# EAGLE design tpms_breakout (EAGLE 9.6.2)

## Sheet 1 of 2
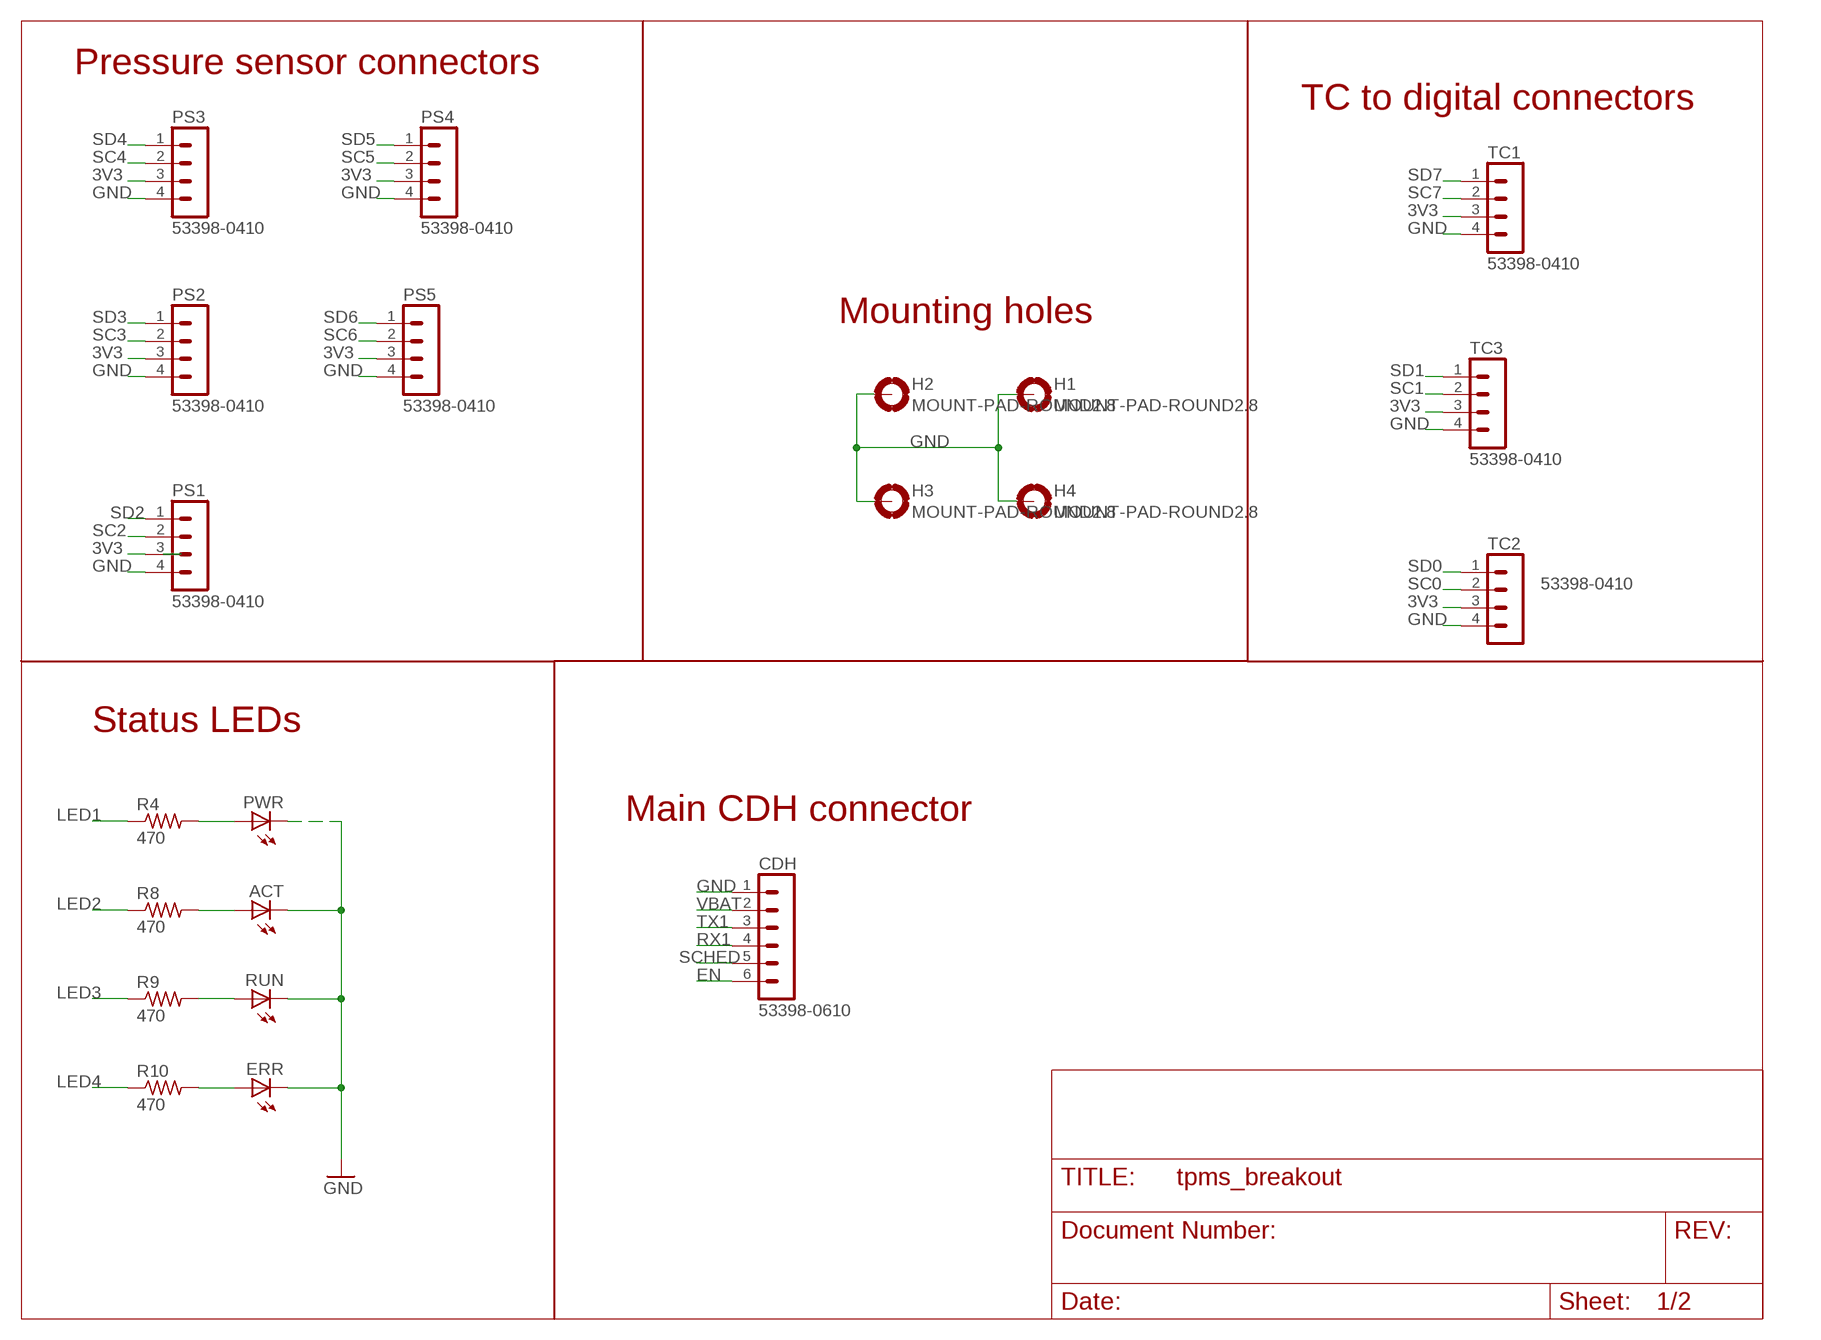
[diagram p0: schematic, sheet 1]

### Parts
ACT  LEDCHIP-LED0603  [CHIP-LED0603]
CDH  53398-0610  [53398-0610]
ERR  LEDCHIP-LED0603  [CHIP-LED0603]
H1  MOUNT-PAD-ROUND2.8  [2,8-PAD]
H2  MOUNT-PAD-ROUND2.8  [2,8-PAD]
H3  MOUNT-PAD-ROUND2.8  [2,8-PAD]
H4  MOUNT-PAD-ROUND2.8  [2,8-PAD]
PS1  53398-0410  [53398-0410]
PS2  53398-0410  [53398-0410]
PS3  53398-0410  [53398-0410]
PS4  53398-0410  [53398-0410]
PS5  53398-0410  [53398-0410]
PWR  LEDCHIP-LED0603  [CHIP-LED0603]
R4  470  R-US_R0603  [R0603]
R8  470  R-US_R0603  [R0603]
R9  470  R-US_R0603  [R0603]
R10  470  R-US_R0603  [R0603]
RUN  LEDCHIP-LED0603  [CHIP-LED0603]
TC1  53398-0410  [53398-0410]
TC2  53398-0410  [53398-0410]
TC3  53398-0410  [53398-0410]

### Nets
3V3: PS1.3 PS2.3 PS3.3 PS4.3 PS5.3 TC1.3 TC2.3 TC3.3 ; also sheet 2
EN: CDH.6 ; also sheet 2
GND: ACT.C CDH.1 ERR.C H1.B2,8(MOUNT) H2.B2,8(MOUNT) H3.B2,8(MOUNT) H4.B2,8(MOUNT) PS1.4 PS2.4 PS3.4 PS4.4 PS5.4 PWR.C RUN.C TC1.4 TC2.4 TC3.4 ; also sheet 2
LED1: R4.1 ; also sheet 2
LED2: R8.1 ; also sheet 2
LED3: R9.1 ; also sheet 2
LED4: R10.1 ; also sheet 2
N$20: PWR.A R4.2
N$21: ACT.A R8.2
N$22: R9.2 RUN.A
N$23: ERR.A R10.2
RX1: CDH.4 ; also sheet 2
SC0: TC2.2 ; also sheet 2
SC1: TC3.2 ; also sheet 2
SC2: PS1.2 ; also sheet 2
SC3: PS2.2 ; also sheet 2
SC4: PS3.2 ; also sheet 2
SC5: PS4.2 ; also sheet 2
SC6: PS5.2 ; also sheet 2
SC7: TC1.2 ; also sheet 2
SCHED: CDH.5 ; also sheet 2
SD0: TC2.1 ; also sheet 2
SD1: TC3.1 ; also sheet 2
SD2: PS1.1 ; also sheet 2
SD3: PS2.1 ; also sheet 2
SD4: PS3.1 ; also sheet 2
SD5: PS4.1 ; also sheet 2
SD6: PS5.1 ; also sheet 2
SD7: TC1.1 ; also sheet 2
TX1: CDH.3 ; also sheet 2
VBAT: CDH.2 ; also sheet 2

### Notes on the sheet
- Pressure sensor connectors
- TC to digital connectors
- Mounting holes
- Status LEDs
- Main CDH connector

## Sheet 2 of 2
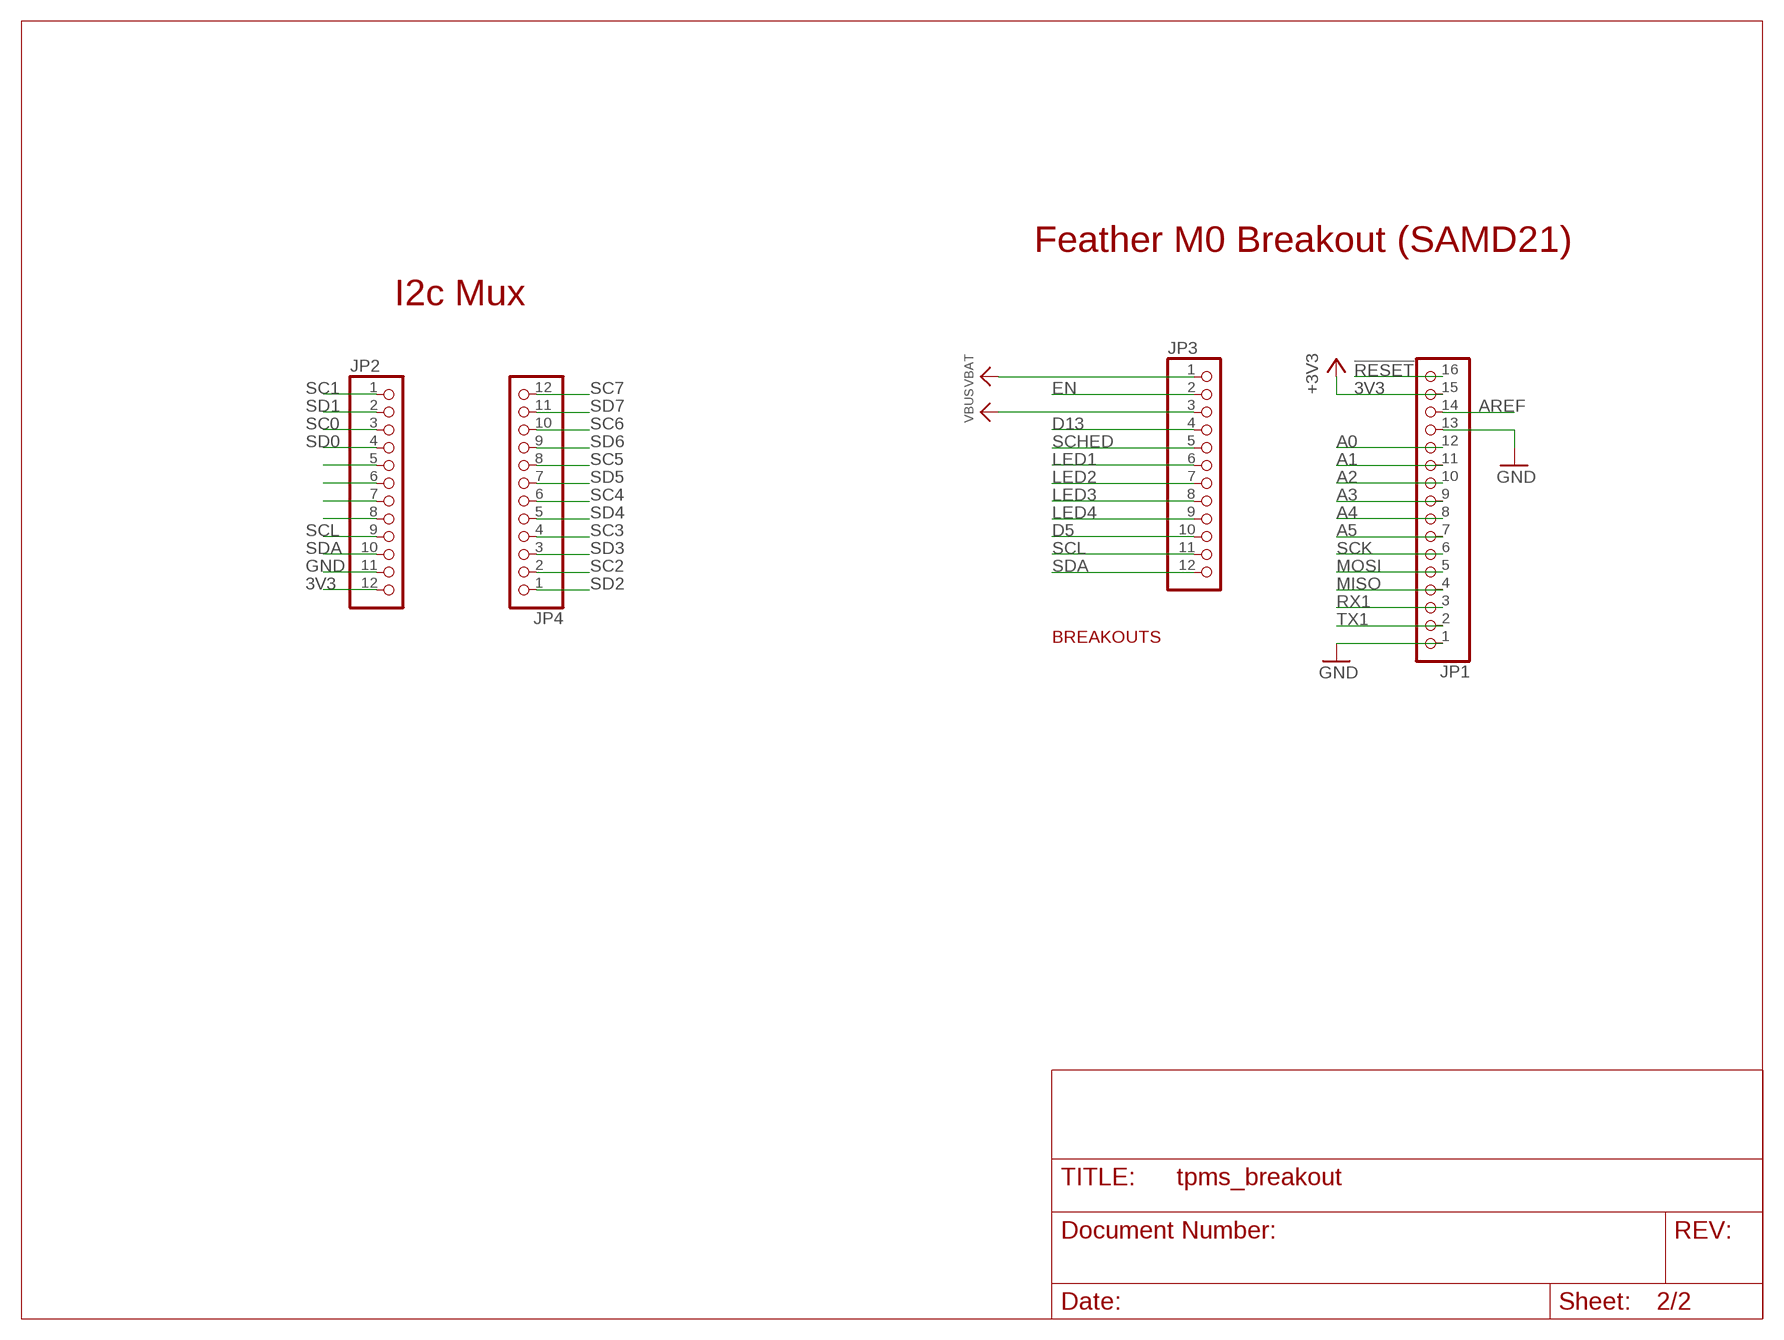
[diagram p1: schematic, sheet 2]

### Parts
JP1  HEADER-1X16ROUND  [1X16_ROUND]
JP2  HEADER-1X12  [1X12_ROUND]
JP3  HEADER-1X12  [1X12_ROUND]
JP4  HEADER-1X12  [1X12_ROUND]

### Nets
3V3: JP1.15 JP2.12 ; supply symbol labelled +3V3 ; also sheet 1
!RESET: JP1.16
A0: JP1.12
A1: JP1.11
A2: JP1.10
A3: JP1.9
A4: JP1.8
A5: JP1.7
AREF: JP1.14
D5: JP3.10
D13: JP3.4
EN: JP3.2 ; also sheet 1
GND: JP1.1 JP1.13 JP2.11 ; also sheet 1
LED1: JP3.6 ; also sheet 1
LED2: JP3.7 ; also sheet 1
LED3: JP3.8 ; also sheet 1
LED4: JP3.9 ; also sheet 1
MISO: JP1.4
MOSI: JP1.5
N$5: JP2.5
N$6: JP2.6
N$7: JP2.7
N$8: JP2.8
RX1: JP1.3 ; also sheet 1
SC0: JP2.3 ; also sheet 1
SC1: JP2.1 ; also sheet 1
SC2: JP4.2 ; also sheet 1
SC3: JP4.4 ; also sheet 1
SC4: JP4.6 ; also sheet 1
SC5: JP4.8 ; also sheet 1
SC6: JP4.10 ; also sheet 1
SC7: JP4.12 ; also sheet 1
SCHED: JP3.5 ; also sheet 1
SCK: JP1.6
SCL: JP2.9 JP3.11
SD0: JP2.4 ; also sheet 1
SD1: JP2.2 ; also sheet 1
SD2: JP4.1 ; also sheet 1
SD3: JP4.3 ; also sheet 1
SD4: JP4.5 ; also sheet 1
SD5: JP4.7 ; also sheet 1
SD6: JP4.9 ; also sheet 1
SD7: JP4.11 ; also sheet 1
SDA: JP2.10 JP3.12
TX1: JP1.2 ; also sheet 1
VBAT: JP3.1 ; also sheet 1
VBUS: JP3.3

### Notes on the sheet
- Feather M0 Breakout (SAMD21)
- I2c Mux
- BREAKOUTS

## Library data of the parts
ACT ERR PWR RUN = adafruit:LED: LED OSRAM: - CHIPLED LG R971, LG N971, LY N971, LG Q971, LY Q971, LO R971, LY R971 LH N974, LH R974 LS Q976, LO Q976, LY Q976 LO Q996 - Hyper CHIPLED LW Q18S LB Q993, LB Q99A, LB R99A - SideLED LS A670, LO A670, LY A670, LG A670, LP A670 LB A673, LV A673, LT A673, LW A673 LH A674 LY A675 LS A676, LA A676, LO A676, LY A676, LW A676 LS A679, LY A679, LG A679 - Hyper Micro SIDELED® LS Y876, LA Y876, LO Y876, LY Y876 LT Y87S - SmartLED LW L88C, LW L88S LB L89C, LB L89S, LG L890 LS L89K, LO L89K, LY L89K LS L896, LA L896, LO L896, LY L896 - TOPLED LS T670, LO T670, LY T670, LG T670, LP T670 LSG T670, LSP T670, LSY T670, LOP T670, LYG T670 LG T671, LOG T671, LSG T671 LB T673, LV T673, LT T673, LW T673 LH T674 LS T676, LA T676, LO T676, LY T676, LB T676, LH T676, LSB T676, LW T676 LB T67C, LV T67C, LT T67C, LS T67K, LO T67K, LY T67K, LW E67C LS E67B, LA E67B, LO E67B, LY E67B, LB E67C, LV E67C, LT E67C LW T67C LS T679, LY T679, LG T679 LS T770, LO T770, LY T770, LG T770, LP T770 LB T773, LV T773, LT T773, LW T773 LH T774 LS E675, LA E675, LY E675, LS T675 LS T776, LA T776, LO T776, LY T776, LB T776 LHGB T686 LT T68C, LB T68C - Hyper Mini TOPLED® LB M676 - Mini TOPLED Santana® LG M470 LS M47K, LO M47K, LY M47K Source: http://www.osram.convergy.de/
CDH = con-molex-picoblade:53398-0610: HEADER
H1-H4 = holes:MOUNT-PAD-ROUND: MOUNTING PAD, round
JP1 = microbuilder:HEADER-1X16: PIN HEADER
JP2-JP4 = microbuilder:HEADER-1X12
PS1-PS5 TC1-TC3 = con-molex-picoblade:53398-0410: HEADER
R4 R8-R10 = rcl:R-US_: RESISTOR, American symbol; SPICEPREFIX: R

## Board
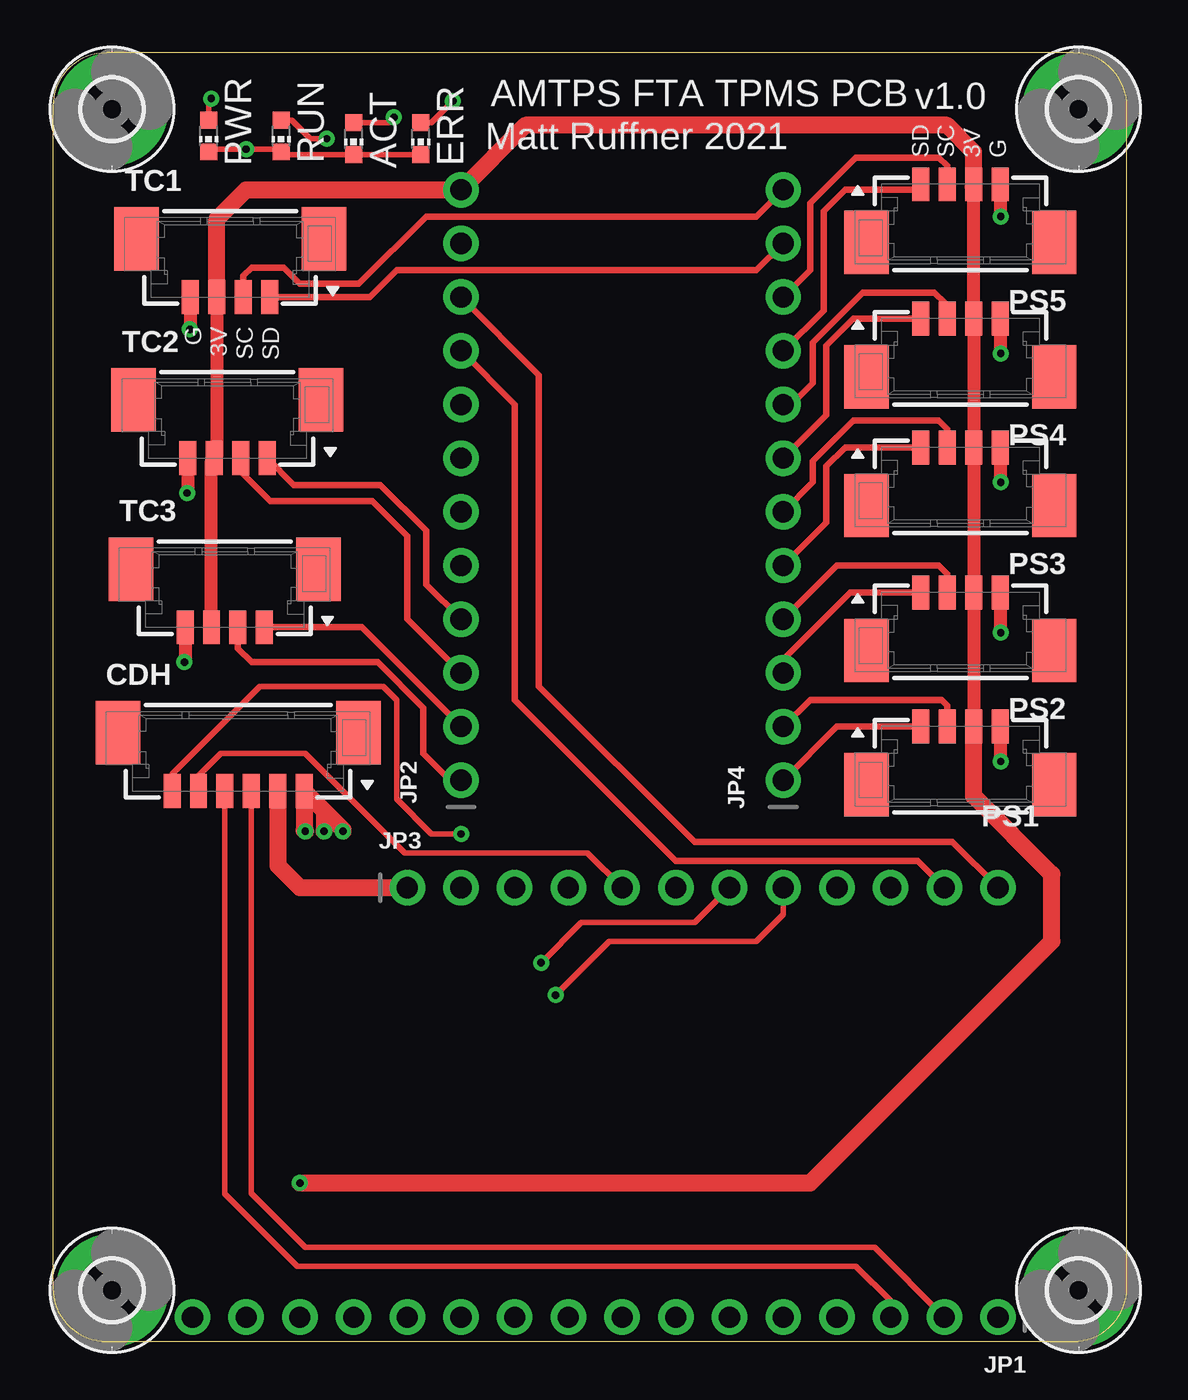
[diagram p2: board, top side]
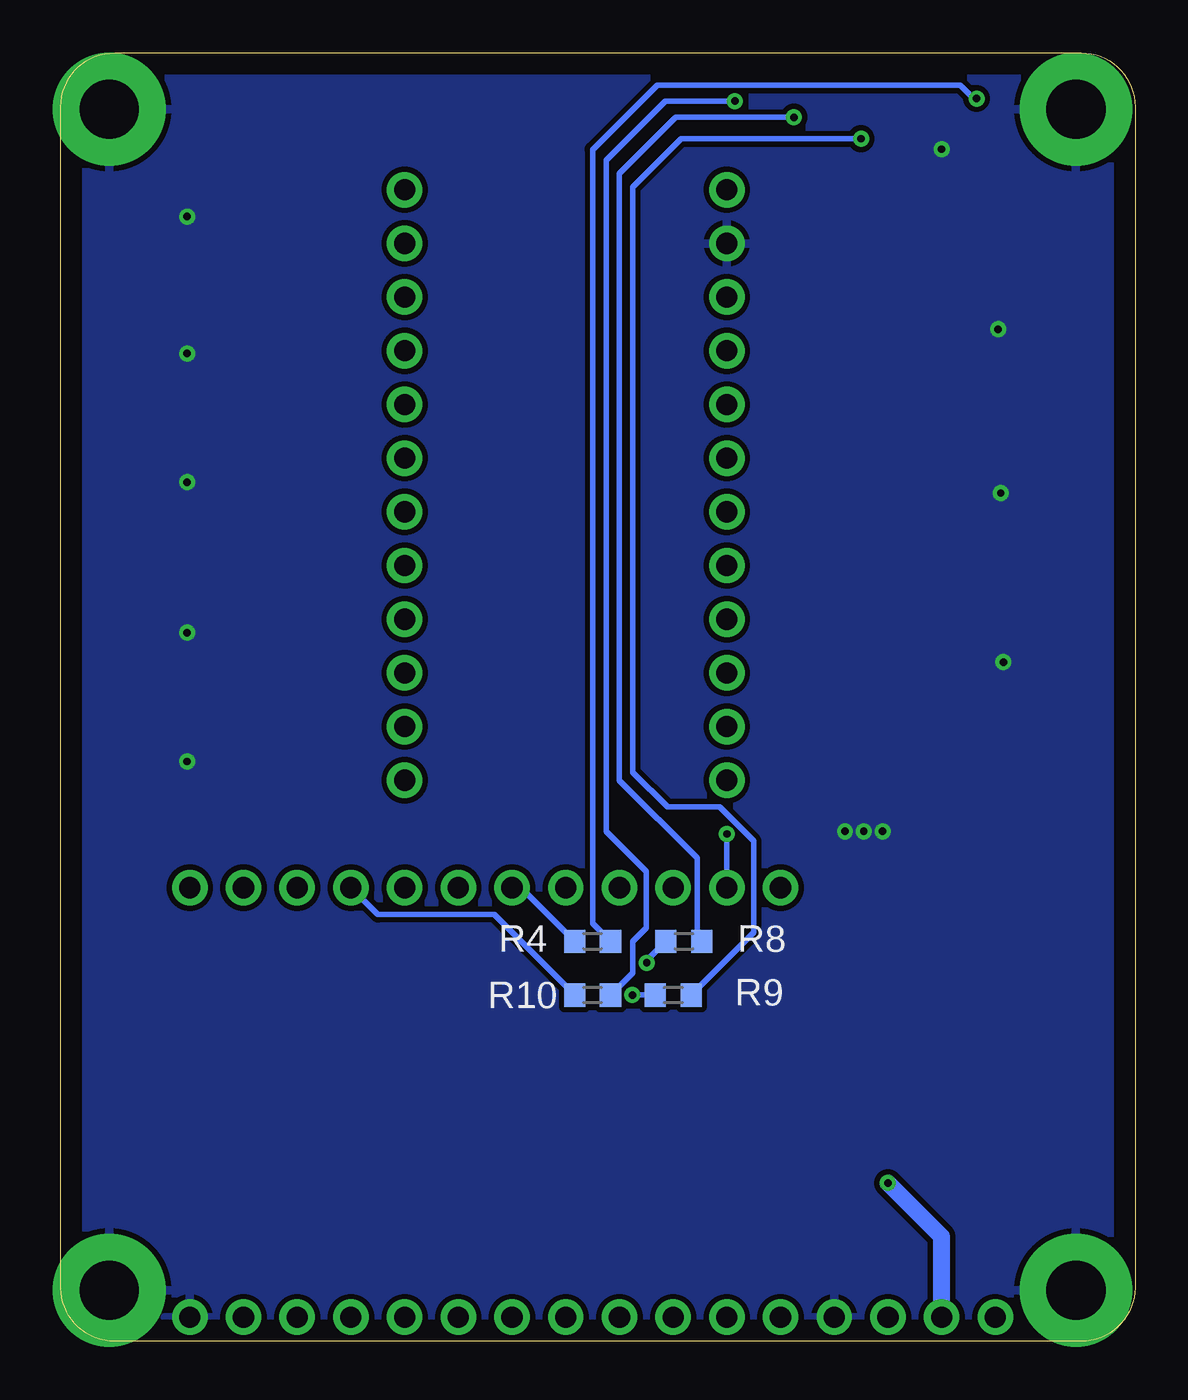
[diagram p3: board, bottom side, seen from below]

Size 50.8 x 60.96 mm. Coordinates in mm from the lower left corner, seen from the top.
Outline: 2.54,0 48.26,0 arc90 50.8,2.54 50.8,58.42 arc90 48.26,60.96 2.54,60.96 arc90 0,58.42 0,2.54 arc90 2.54,0
Copper layers (1*16): Top 0.035mm / dielectric 1.5mm / Bottom 0.035mm
Design rules "default *": minimum track width 6mil, minimum drill 0.35mm, track to track 6mil, track to pad 6mil, pad to pad 6mil, via to via 6mil, smd to smd 6mil, copper to edge 40mil, drill to drill 6mil, minimum pad ring 10mil, minimum via ring 8mil, stop-mask expansion 4mil, vias tented up to drill 14mil, thermal gap 10mil

### Footprints (pad centres in the part's own frame; a part is rotated, then mirrored left to right if it is on the bottom)
CHIP-LED0603 = smd 0.8 x 0.8: A 0,-0.75; C 0,0.75
53398-0610 = smd 0.8 x 1.6: 1 3.125,0; 2 1.875,0; 3 0.625,0; 4 -0.625,0; 5 -1.875,0; 6 -3.125,0 | smd 2.1 x 3: M1 5.685,2.75; M2 -5.685,2.75
2,8-PAD = drill 2.8 pad 5.334: B2,8 0,0
1X16_ROUND = drill 1 pad 1.676: 1 -19.05,0; 2 -16.51,0; 3 -13.97,0; 4 -11.43,0; 5 -8.89,0; 6 -6.35,0; 7 -3.81,0; 8 -1.27,0; 9 1.27,0; 10 3.81,0; 11 6.35,0; 12 8.89,0; 13 11.43,0; 14 13.97,0; 15 16.51,0; 16 19.05,0
1X12_ROUND = drill 1 pad 1.676: 1 -13.97,0; 2 -11.43,0; 3 -8.89,0; 4 -6.35,0; 5 -3.81,0; 6 -1.27,0; 7 1.27,0; 8 3.81,0; 9 6.35,0; 10 8.89,0; 11 11.43,0; 12 13.97,0
53398-0410 = smd 0.8 x 1.6: 1 1.875,0; 2 0.625,0; 3 -0.625,0; 4 -1.875,0 | smd 2.1 x 3: M1 4.435,2.75; M2 -4.435,2.75
R0603 = smd 1 x 1.1: 1 -0.85,0; 2 0.85,0

### Placement (x,y rotation side)
ACT  14.22,56.9 180 top
CDH  8.76,26.04 0 top
ERR  17.4,56.9 180 top
H1  2.79,2.41 0 top
H2  48.51,2.41 0 top
H3  2.79,58.29 0 top
H4  48.51,58.29 0 top
JP1  25.65,1.14 180 top
JP2  19.3,40.51 90 top
JP3  30.73,21.46 0 top
JP4  34.54,40.51 90 top
PS1  42.93,29.08 180 top
PS2  42.93,35.43 180 top
PS3  42.93,42.29 180 top
PS4  42.93,48.39 180 top
PS5  42.93,54.74 180 top
PWR  7.37,57.02 180 top
R4  25.65,18.92 0 bottom
R8  21.34,18.92 0 bottom
R9  21.84,16.38 0 bottom
R10  25.65,16.38 0 bottom
RUN  10.79,57.02 180 top
TC1  8.38,49.4 0 top
TC2  8.25,41.78 0 top
TC3  8.13,33.78 0 top

### Tracks (layer width: path | path; a pad name or v marks a point on that pad's centre or on a via)
3V3  (via drill 0.35)
  Top 0.61: TC3.3 7.5,41.66 TC2.3 7.76,41.91 TC1.3 | PS5.3 43.42,54.61 43.55,54.48 PS4.3 PS3.3 PS2.3 PS1.3
  Top 0.813: PS1.3 43.55,25.79 47.24,22.1 47.24,18.92 35.81,7.49 v11.68,7.49 | PS5.3 43.55,56.27 42.29,57.53 22.35,57.53 JP2.12 9.14,54.48 7.76,53.1 TC1.3
  Bottom 0.813: JP1.15 9.14,4.95 v11.68,7.49
EN  (via drill 0.35)
  Top 0.254: CDH.6 5.64,26.85 9.78,30.99 15.62,30.99 16.26,30.35 16.26,25.65 17.91,24 v19.3,24
  Bottom 0.254: v19.3,24 JP3.2
GND  (via drill 0.35)
  Top 0.254: ACT.C ERR.C 10.92,56.15 RUN.C 10.67,56.4 v9.14,56.4 7.49,56.4 PWR.C
  Top 0.61: PS5.4 44.8,53.24 v44.83,53.21 | PS4.4 44.8,46.77 v44.83,46.74 | PS3.4 44.8,40.67 v44.83,40.64 | PS2.4 44.8,33.56 v44.83,33.53 | PS1.4 44.8,27.46 v44.83,27.43 | TC1.4 6.51,47.91 v6.48,47.88 | TC2.4 6.38,40.16 v6.35,40.13 | TC3.4 6.25,32.16 v6.22,32.13
  Top 0.813: v11.94,24.13 11.89,24.18 CDH.1 12.83,25.1 | 12.83,25.1 v12.83,24.13 | 12.83,25.1 13.72,24.21 v13.72,24.13
  pour Bottom (isolate 0.254): -1.02,63.37 51.05,63.37 52.32,62.1 53.59,60.83 53.59,1.14 51.05,-1.4 49.78,-1.4 0.25,-1.4 -3.56,2.41 -3.56,60.83
LED1
  Bottom 0.254: R4.1 29.04,21.46 JP3.6
LED2  (via drill 0.35)
  Top 0.254: v23.09,17.91 25,19.81 30.35,19.81 JP3.7
  Bottom 0.254: R8.1 23.09,18.02 v23.09,17.91
LED3  (via drill 0.35)
  Top 0.254: v23.77,16.38 26.31,18.92 33.27,18.92 34.54,20.19 JP3.8
  Bottom 0.254: R9.1 v23.77,16.38
LED4
  Bottom 0.254: R10.1 30.31,20.19 35.81,20.19 JP3.9
N$20  (via drill 0.35)
  Top 0.254: v7.49,58.8 7.37,58.67 PWR.A
  Bottom 0.254: v7.49,58.8 7.62,58.8 8.25,59.44 22.61,59.44 25.65,56.39 25.65,19.77 R4.2
N$21  (via drill 0.35)
  Top 0.254: v16.13,57.91 15.86,57.65 ACT.A
  Bottom 0.254: v16.13,57.91 21.72,57.91 24.38,55.24 24.38,26.54 20.7,22.86 20.7,20.19 20.7,20.07 20.7,19.14 R8.2
N$22  (via drill 0.35)
  Top 0.254: v12.95,56.9 12.18,56.9 11.3,57.77 RUN.A
  Bottom 0.254: R9.2 18.03,19.34 18.03,23.66 19.64,25.27 22.1,25.27 23.75,26.92 23.75,54.61 21.46,56.9 v12.95,56.9
N$23  (via drill 0.35)
  Top 0.254: ERR.A 17.89,57.65 v18.92,58.67
  Bottom 0.254: v18.92,58.67 22.23,58.67 25.02,55.88 25.02,24.13 23.11,22.23 23.11,19.56 23.75,18.92 23.75,17.44 R10.2
RX1
  Top 0.254: CDH.4 8.14,6.98 11.56,3.56 37.97,3.56 39.62,1.91 JP1.3
SC0
  Top 0.305: TC2.2 8.88,41.16 10.29,39.75 15.11,39.75 16.76,38.1 16.76,34.16 JP2.3
SC1
  Top 0.305: TC3.2 8.75,32.78 9.4,32.13 15.37,32.13 17.53,29.97 17.53,27.81 18.8,26.54 JP2.1
SC2
  Top 0.305: PS1.2 42.3,30.09 42.04,30.35 35.81,30.35 JP4.2
SC3
  Top 0.305: PS2.2 42.3,36.31 41.91,36.7 37.08,36.7 JP4.4
SC4
  Top 0.305: JP4.6 35.94,40.64 35.94,41.66 37.85,43.56 41.91,43.56 42.3,43.17 PS3.2
SC5
  Top 0.305: PS4.2 42.17,49.14 41.69,49.62 38.32,49.62 35.94,47.24 35.94,45.34 34.92,44.32 JP4.8
SC6
  Top 0.305: PS5.2 42.3,55.62 41.91,56.01 37.97,56.01 35.81,53.85 35.81,50.67 JP4.10
SC7
  Top 0.305: JP4.12 33.27,53.21 17.65,53.21 14.48,50.04 11.68,50.04 10.92,50.8 9.4,50.8 9.01,50.41 TC1.2
SCHED
  Top 0.254: CDH.5 6.82,26.1 6.82,26.7 7.94,27.81 11.94,27.81 16.64,23.11 25.27,23.11 JP3.5
SCL
  Top 0.305: JP3.11 40.89,22.73 29.46,22.73 21.84,30.35 21.84,44.32 JP2.9
SD0
  Top 0.305: TC2.1 11.4,40.51 15.49,40.51 17.65,38.35 17.65,35.81 JP2.4
SD1
  Top 0.305: TC3.1 14.61,33.78 JP2.2
SD2
  Top 0.305: PS1.1 37.08,29.08 JP4.1
SD3
  Top 0.305: PS2.1 37.72,35.43 34.54,32.26 JP4.3
SD4
  Top 0.305: PS3.1 37.46,42.29 36.58,41.4 36.58,38.73 JP4.5
SD5
  Top 0.305: PS4.1 37.85,48.39 36.58,47.12 36.58,43.81 JP4.7
SD6
  Top 0.305: PS5.1 40.8,54.48 37.46,54.48 36.45,53.47 36.45,48.77 JP4.9
SD7
  Top 0.305: JP4.11 33.27,50.67 16.26,50.67 14.99,49.4 TC1.1
SDA
  Top 0.305: JP3.12 42.54,23.62 30.35,23.62 22.99,30.99 22.99,45.72 JP2.10
TX1
  Top 0.254: CDH.3 9.39,7 11.94,4.45 38.86,4.45 JP1.2
VBAT
  Top 0.813: CDH.2 10.64,22.51 11.68,21.46 JP3.1

### Text on the board
tNames: AMTPS FTA TPMS PCB | v1.0 | Matt Ruffner 2021 | SD / SC / 3V / G | G / 3V / SC / SD